# Altium schematic sheet Overview.SchDoc
size A; SheetNumber: 1; SheetTotal: 4
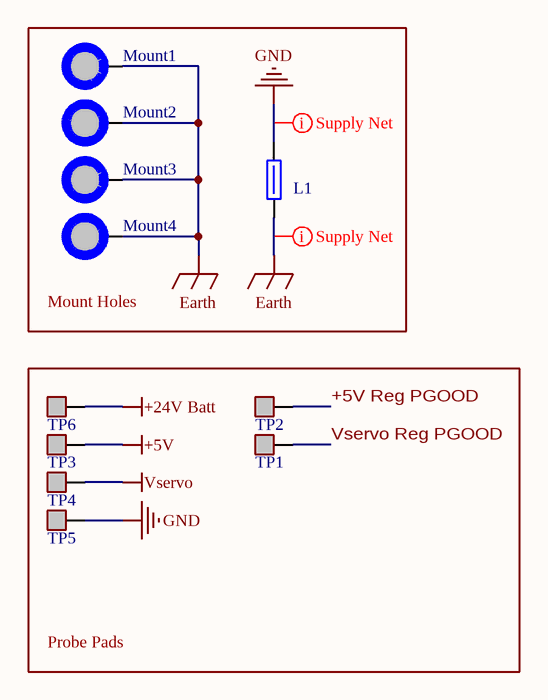
[diagram p0: Overview.SchDoc]

## Parts
L1  652-MH2029-300Y  [[Ferrite] SMD Bead 0805 (1)]  (value not drawn)
Mount1  M3 Mount Hole  [[Mount] M3 Mount Hole]  (value not drawn)  (no BOM)
Mount2  M3 Mount Hole  [[Mount] M3 Mount Hole]  (value not drawn)  (no BOM)
Mount3  M3 Mount Hole  [[Mount] M3 Mount Hole]  (value not drawn)  (no BOM)
Mount4  M3 Mount Hole  [[Mount] M3 Mount Hole]  (value not drawn)  (no BOM)
TP1  Probe Pad  [[Probe] Touch Pad]  (value not drawn)  (no BOM)
TP2  Probe Pad  [[Probe] Touch Pad]  (value not drawn)  (no BOM)
TP3  Probe Pad  [[Probe] Touch Pad]  (value not drawn)  (no BOM)
TP4  Probe Pad  [[Probe] Touch Pad]  (value not drawn)  (no BOM)
TP5  Probe Pad  [[Probe] Touch Pad]  (value not drawn)  (no BOM)
TP6  Probe Pad  [[Probe] Touch Pad]  (value not drawn)  (no BOM)

## Blocks framed on the sheet
Mount Holes: L1 Mount1-Mount4
Probe Pads: TP1-TP6

## Nets
+5V: TP3.1
+24V Batt: TP6.1
Earth: L1.1 Mount1.1 Mount2.1 Mount3.1 Mount4.1
GND: L1.2 TP5.1
Vservo: TP4.1
+5V Reg PGOOD: TP2.1
Vservo Reg PGOOD: TP1.1

## Layout directives
net class Supply_Nets: Earth, GND

## Library data of the parts
L1 = [Ferrite] SMD Ferrite Bead (1): Res @ Freq: 30 @ 100MHz; Size Package: 0805; Supplier 1: DigiKey; Supplier Part Number 1: MH2029-300YCT-ND
Mount1-Mount4 = [Mount] M3 Mount Hole: Place at least 4.5mm from board edge. Plated.
TP1-TP6 = [Probe] Touch Pad